# Altium schematic sheet Sheet3.SchDoc
size A
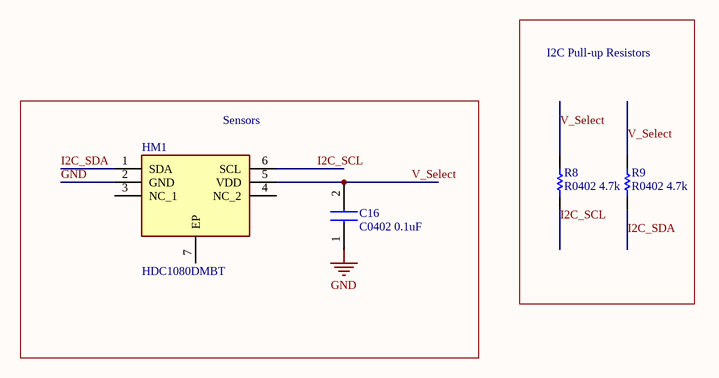
[diagram p0: Sheet3.SchDoc]

## Parts
C16  C0402 0.1uF  [CAPC0603X33N]
HM1  HDC1080DMBT  [SON100P300X300X80-7N]
R8  R0402 4.7k  [RESC1005X40X25NL05T05]
R9  R0402 4.7k  [RESC1005X40X25NL05T05]

## Blocks framed on the sheet
I2C Pull-up Resistors: R8 R9
Sensors: C16 HM1

## Nets
GND: C16.1 HM1.2(GND)
I2C_SCL: HM1.6(SCL) R8.1
I2C_SDA: HM1.1(SDA) R9.1
V_Select: C16.2 HM1.5(VDD) R8.2 R9.2

Not connected (* = marked no-connect by the designer): HM1 3(NC_1) 4(NC_2) 7(EP)

## Library data of the parts
C16 = 02014D474MAT2A: Capacitor; Manufacturer_Name: AVX; Datasheet Link: http://www.mouser.com/catalog/supplier/library/pdf/AVXSurfaceMountCeramic.pdf; Height: 0.33mm; Manufacturer_Part_Number: 02014D474MAT2A; Mouser Part Number: 581-02014D474MAT2A; Mouser Price/Stock: https://www.mouser.com/Search/Refine.aspx?Keyword=581-02014D474MAT2A
HM1 = HDC1080DMBT: Hygrometer; Manufacturer_Name: Texas Instruments; Datasheet Link: http://www.mouser.com/ds/2/405/hdc1080-844688.pdf; Height: 0.8mm; Manufacturer_Part_Number: HDC1080DMBT; Mouser Part Number: 595-HDC1080DMBT; Mouser Price/Stock: https://www.mouser.com/Search/Refine.aspx?Keyword=595-HDC1080DMBT; RS Part Number: 1330170P; RS Price/Stock: http://uk.rs-online.com/web/p/products/1330170P
R8 R9 = CMP-2002-08135-1: Manufacturer: Vishay Dale; Part Number: CRCW040210K0FKED